# EAGLE design Attiny85VUSB (EAGLE 7.4.0)
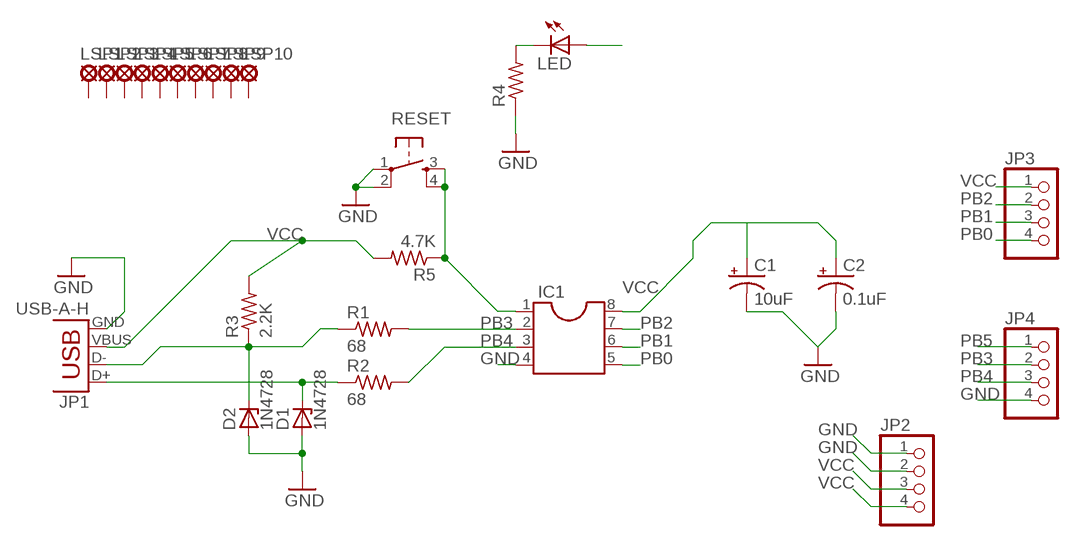
[diagram p0: schematic, sheet 1]

## Parts
C1  10uF  CAP_POLPTH1  [CPOL-RADIAL-100UF-25V]
C2  0.1uF  CAP_POLPTH1  [CPOL-RADIAL-100UF-25V]
D1  1N4728  [DO41Z10]
D2  1N4728  [DO41Z10]
IC1  ATTINY85TESTS  [SOCKET-08]
JP1  USB-A-H  [USB-A-H]
JP2  PINHD-1X4  [1X04]
JP3  PINHD-1X4  [1X04]
JP4  PINHD-1X4  [1X04]
LED  LED5MM  [LED5MM]
LSP1  MCS08  [MCS08]
LSP2  MCS08  [MCS08]
LSP3  MCS08  [MCS08]
LSP4  MCS08  [MCS08]
LSP5  MCS08  [MCS08]
LSP6  MCS08  [MCS08]
LSP7  MCS08  [MCS08]
LSP8  MCS08  [MCS08]
LSP9  MCS08  [MCS08]
LSP10  MCS08  [MCS08]
R1  68  R-US_0207/9  [0207/9]
R2  68  R-US_0207/9  [0207/9]
R3  2.2K  R-US_0207/9  [0207/9]
R4  R-US_0207/9  [0207/9]
R5  4.7K  R-US_0207/9  [0207/9]
RESET  TAC_SWITCHPTH  [TACTILE-PTH]

## Nets
DMIN: D2.C JP1.D- R1.1 R3.1
DPLUS: D1.C JP1.D+ R2.1
GND: C1.2(-) C2.2(-) D1.A D2.A IC1.4(GND) JP1.GND JP2.1 JP2.2 JP4.4 R4.1 RESET.1 RESET.2
N$2: LED.K(C) R4.2
PB0: IC1.5(PB0MOSI) JP3.4
PB1: IC1.6(PB1_MISO) JP3.3 LED.A
PB2: IC1.7(PB2SCK) JP3.2
PB3: IC1.2(PB3_CLKI) JP4.2 R1.2
PB4: IC1.3(PB4_CLKO) JP4.3 R2.2
PB5: JP4.1
RESET: IC1.1(PB5_~RESET) R5.1 RESET.3 RESET.4
VCC: C1.1(+) C2.1(+) IC1.8(VCC) JP1.VBUS JP2.3 JP2.4 JP3.1 R3.2 R5.2
Unconnected: LSP1.MP LSP2.MP LSP3.MP LSP4.MP LSP5.MP LSP6.MP LSP7.MP LSP8.MP LSP9.MP LSP10.MP

## Library data of the parts
C1 C2 = SparkFun-Capacitors:CAP_POL: Capacitor Polarized These are standard SMD and PTH capacitors. Normally 10uF, 47uF, and 100uF in electrolytic and tantalum varieties. Always verify the external diameter of the through hole cap, it varies with capacity, voltage, and manufacturer. The EIA devices should be standard.
D1 D2 = diode:1N4728: Z DIODE 3.3 V, 1W, 5 percent
IC1 = digital-ic:ATTINY85TEST: ATTiny85 Test
JP1 = SparkFun-Connectors:USB: USB Connectors USB-B-PTH is fully proven SKU : PRT-00139/CONN-08278 USB-miniB is fully proven SKU : PRT-00587 USB-A-PCB is untested. USB-A-H is throughly reviewed, but untested. Spark Fun Electronics SKU : PRT-00437 USB-B-SMT is throughly reviewed, but untested. Needs silkscreen touching up. USB-A-S has not been used/tested USB-MB-H has not been used/tested USB-MICROB has been used. CONN-09505; PROD_ID: CONN-08367
JP2-JP4 = pinhead:PINHD-1X4: PIN HEADER
LED = adafruit:LED: LED OSRAM: - CHIPLED LG R971, LG N971, LY N971, LG Q971, LY Q971, LO R971, LY R971 LH N974, LH R974 LS Q976, LO Q976, LY Q976 LO Q996 - Hyper CHIPLED LW Q18S LB Q993, LB Q99A, LB R99A - SideLED LS A670, LO A670, LY A670, LG A670, LP A670 LB A673, LV A673, LT A673, LW A673 LH A674 LY A675 LS A676, LA A676, LO A676, LY A676, LW A676 LS A679, LY A679, LG A679 - Hyper Micro SIDELED® LS Y876, LA Y876, LO Y876, LY Y876 LT Y87S - SmartLED LW L88C, LW L88S LB L89C, LB L89S, LG L890 LS L89K, LO L89K, LY L89K LS L896, LA L896, LO L896, LY L896 - TOPLED LS T670, LO T670, LY T670, LG T670, LP T670 LSG T670, LSP T670, LSY T670, LOP T670, LYG T670 LG T671, LOG T671, LSG T671 LB T673, LV T673, LT T673, LW T673 LH T674 LS T676, LA T676, LO T676, LY T676, LB T676, LH T676, LSB T676, LW T676 LB T67C, LV T67C, LT T67C, LS T67K, LO T67K, LY T67K, LW E67C LS E67B, LA E67B, LO E67B, LY E67B, LB E67C, LV E67C, LT E67C LW T67C LS T679, LY T679, LG T679 LS T770, LO T770, LY T770, LG T770, LP T770 LB T773, LV T773, LT T773, LW T773 LH T774 LS E675, LA E675, LY E675, LS T675 LS T776, LA T776, LO T776, LY T776, LB T776 LHGB T686 LT T68C, LB T68C - Hyper Mini TOPLED® LB M676 - Mini TOPLED Santana® LG M470 LS M47K, LO M47K, LY M47K Source: http://www.osram.convergy.de/
LSP1-LSP10 = solpad:MCS08: SOLDER PAD MC S0,8, drill 1.2 mm, distributor Buerklin, 08F130
R1-R5 = adafruit:R-US_: RESISTOR, American symbol
RESET = SparkFun-Retired:TAC_SWITCH: Momentary Switch Button commonly used for reset or general input. Spark Fun Electronics SKU : COM-00097 SMT- SWCH-08247

## Board
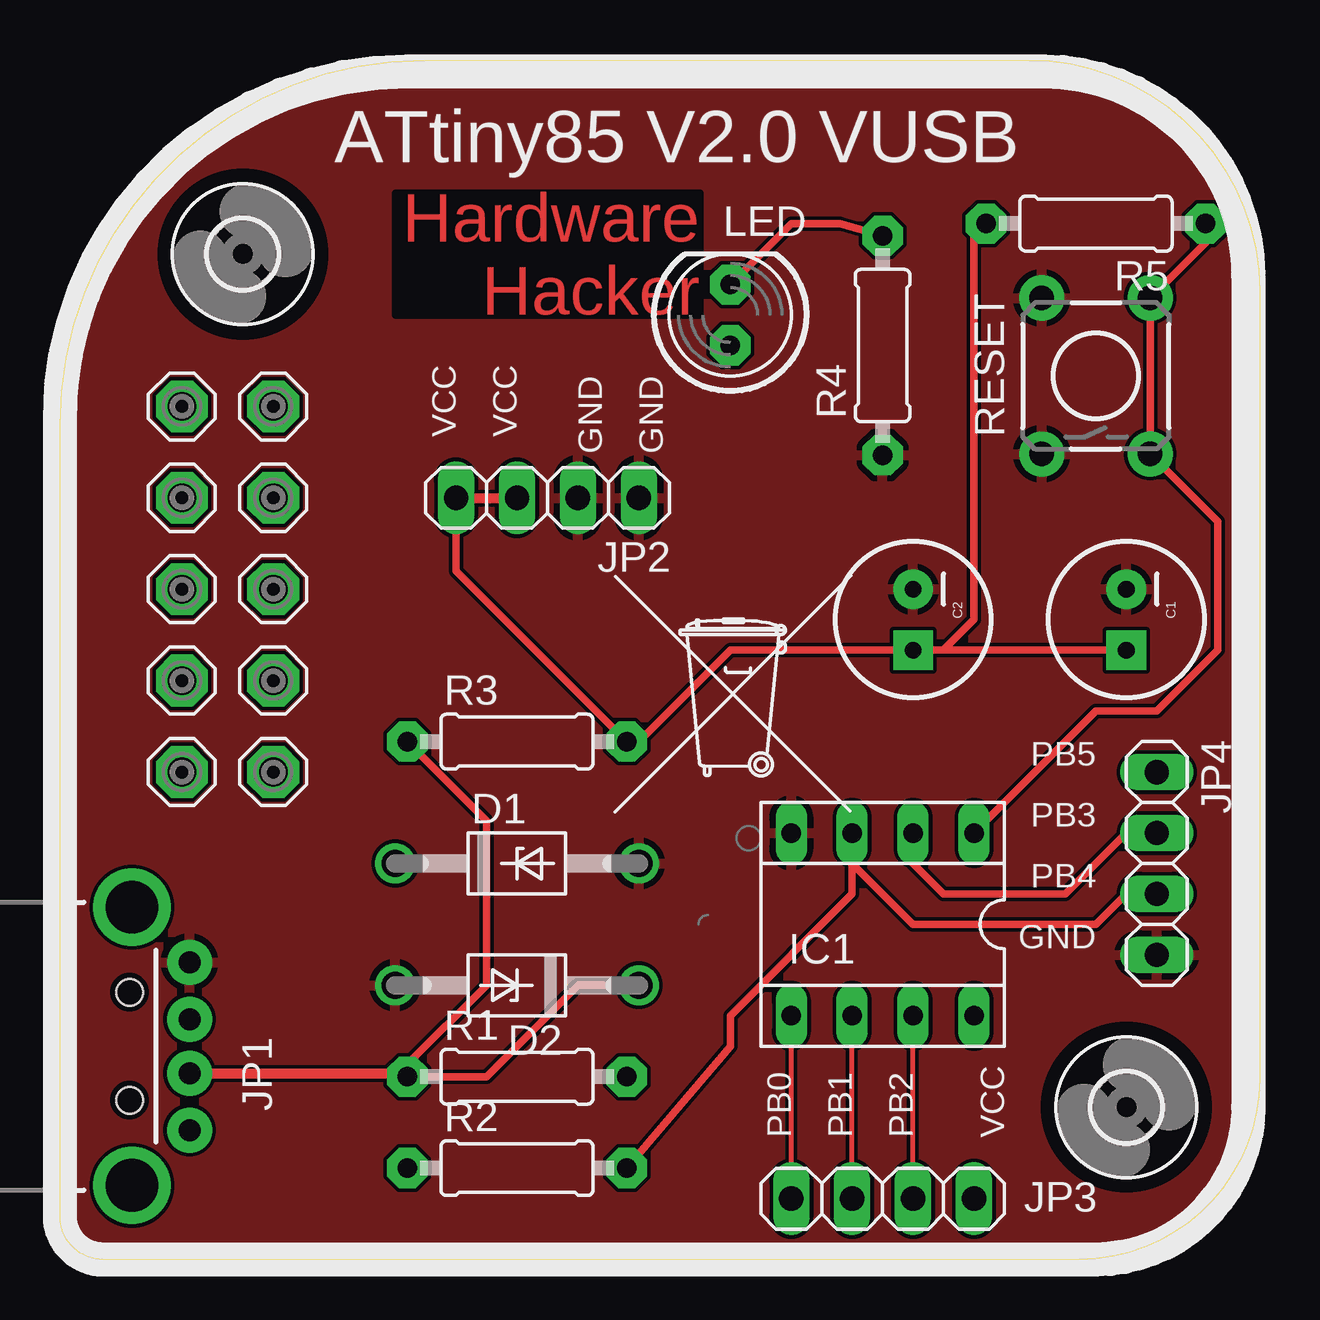
[diagram p1: board, top side]
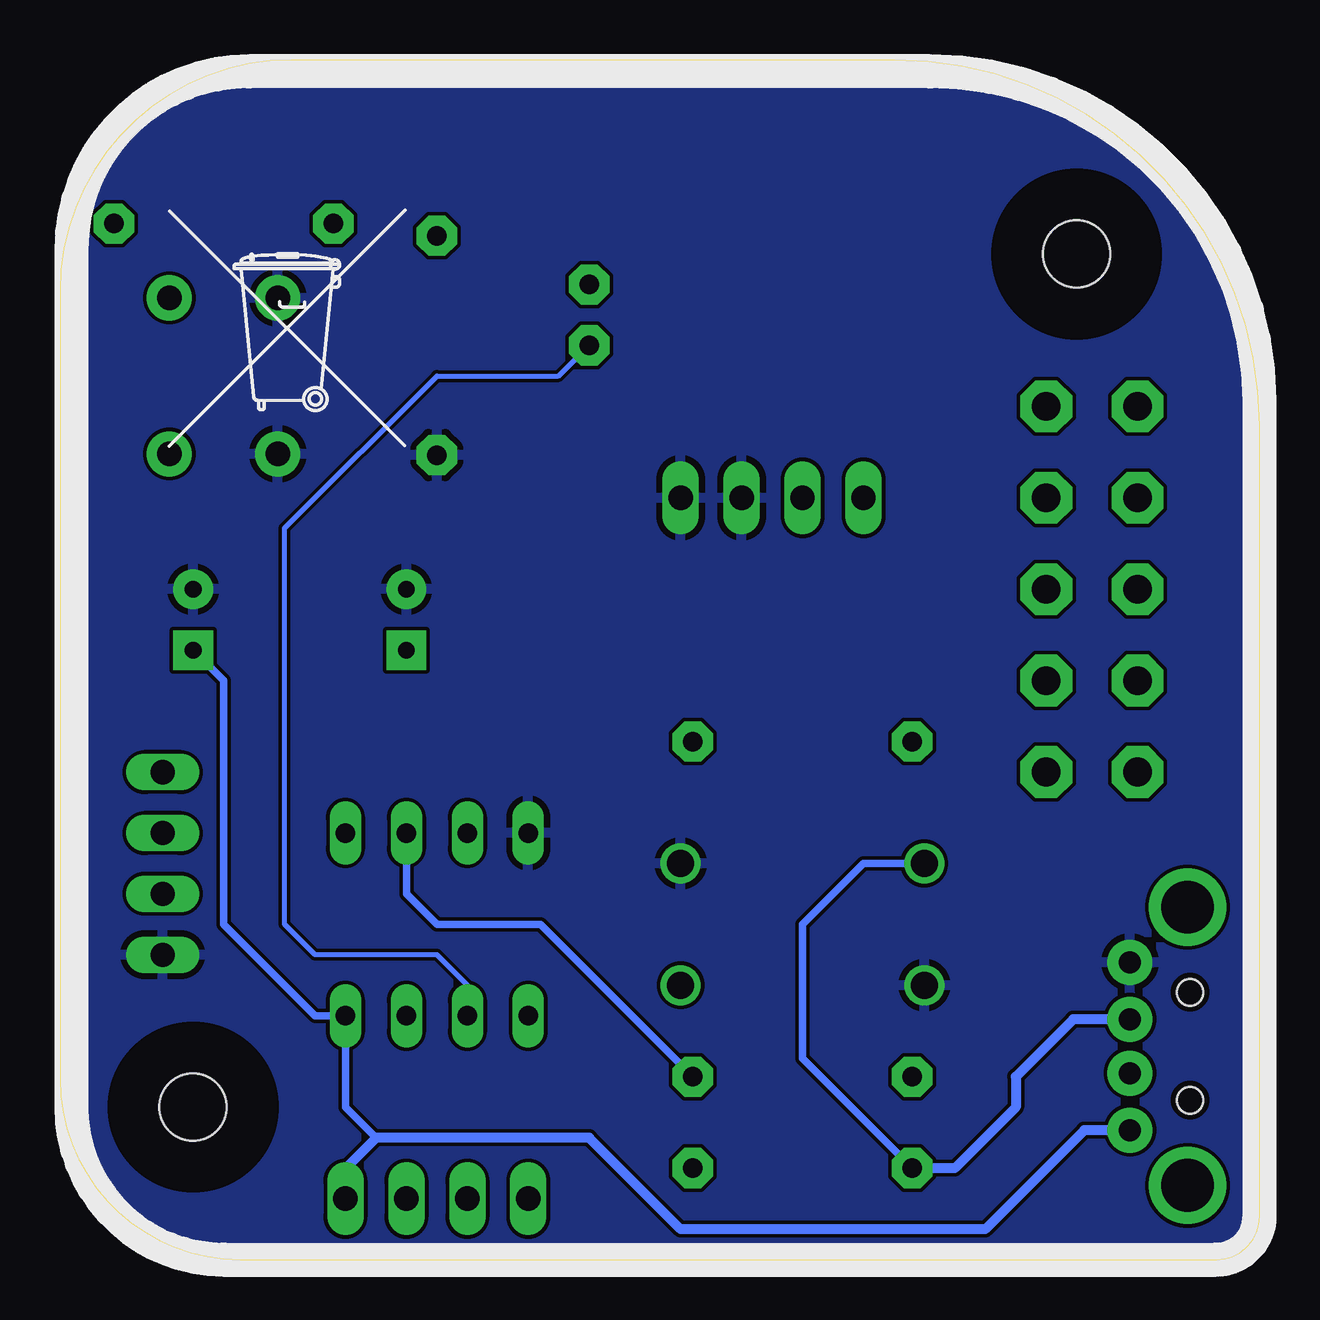
[diagram p2: board, bottom side, seen from below]

Size 50 x 50 mm. Coordinates in mm from the lower left corner, seen from the top.
Outline: 50,40.35 50,7.52 arc-90 42.48,0 1.8,0 arc-90 0,1.8 0,34.78 arc-90 15.22,50 40.35,50 arc-90 50,40.35
Copper layers (1*16): Top 0.035mm / dielectric 1.5mm / Bottom 0.035mm
Design rules "SeeedStudio_2layer_DRU_no_angle_20140221": minimum track width 6mil, minimum drill 12mil, track to track 6mil, track to pad 6mil, pad to pad 6mil, via to via 6mil, smd to smd 0mil, copper to edge 10mil, drill to drill 10mil, minimum pad ring 10mil, minimum via ring 6mil, stop-mask expansion 2mil, vias tented up to drill 100mil, thermal gap 10mil

### Footprints (pad centres in the part's own frame; a part is rotated, then mirrored left to right if it is on the bottom)
CPOL-RADIAL-100UF-25V = drill 0.7 pad 1.651 square: 1 1.27,0 | drill 0.7 pad 1.651: 2 -1.27,0
DO41Z10 = drill 1.118: A 5.08,0; C -5.08,0
SOCKET-08 = drill 0.813 long: 1 -3.81,-3.81; 2 -1.27,-3.81; 3 1.27,-3.81; 4 3.81,-3.81; 5 3.81,3.81; 6 1.27,3.81; 7 -1.27,3.81; 8 -3.81,3.81
USB-A-H = drill 0.914 pad 1.88: D+ 2.4,1.127; D- 2.4,-1.127; GND 2.4,3.5; VBUS 2.4,-3.5 | drill 2.2: GND2 0,-5.8; GND3 0,5.8 | hole 1.1: -0.1,2.25; -0.1,-2.25
1X04 = drill 1.016 long: 1 -3.81,0; 2 -1.27,0; 3 1.27,0; 4 3.81,0
LED5MM = drill 0.813 pad 1.676 octagon: A -1.27,0; K 1.27,0
MCS08 = drill 1.194 pad 2.159 octagon: MP 0,0
0207/9 = drill 0.813 pad 1.676 octagon: 1 -4.572,0; 2 4.572,0
TACTILE-PTH = drill 1.016 pad 1.88: 1 -3.251,2.261; 2 3.251,2.261; 3 -3.251,-2.261; 4 3.251,-2.261
2,8 = hole 2.8: 0,0

### Placement (x,y rotation side)
C1  44.45,26.67 270 top
C2  35.56,26.67 270 top
D1  19.05,16.51 0 top
D2  19.05,11.43 180 top
IC1  34.29,13.97 180 top
JP1  3,8.89 0 top
JP2  20.32,31.75 180 top
JP3  34.29,2.54 180 top
JP4  45.72,16.51 270 top
LED  27.94,39.37 90 top
LSP1  5.08,31.75 0 top
LSP2  8.89,20.32 0 top
LSP3  5.08,27.94 0 top
LSP4  8.89,31.75 0 top
LSP5  5.08,35.56 0 top
LSP6  5.08,24.13 0 top
LSP7  8.89,24.13 0 top
LSP8  8.89,27.94 0 top
LSP9  8.89,35.56 0 top
LSP10  5.08,20.32 0 top
R1  19.05,7.62 0 top
R2  19.05,3.81 0 top
R3  19.05,21.59 0 top
R4  34.29,38.1 90 top
R5  43.18,43.18 180 top
RESET  43.18,36.83 90 top
U$1  [TONNE_10.00]  27.94,21.59 0 top
U$2  [TONNE_10.00]  40.64,36.83 0 bottom
U$3  [2,8]  44.45,6.35 0 top
U$4  [2,8]  7.62,41.91 0 top
U$5  [LOGO]  29.21,10.16 90 top

### Tracks (layer width: path | path; a pad name or v marks a point on that pad's centre or on a via)
DMIN
  Top 0.305: D2.C 21.59,11.43 17.78,7.62 R1.1 14.48,8.13 17.78,11.43 17.78,18.29 R3.1
  Top 0.406: JP1.D- 14.34,7.76 R1.1
DPLUS
  Bottom 0.305: D1.C 16.51,16.51 19.05,13.97 19.05,8.38 R2.1
  Bottom 0.406: JP1.D+ 7.76,10.02 10.16,7.62 10.16,6.35 12.7,3.81 R2.1
GND
  pour Top: 0,0 50,0 50,50 0,50
  pour Bottom: 0,0 50,0 50,50 0,50
N$2
  Top 0.305: LED.K 30.48,43.18 32.51,43.18 R4.2
PB0
  Top 0.203: JP3.4 IC1.5
PB1
  Top 0.203: JP3.3 IC1.6
  Bottom 0.203: IC1.6 33.02,11.43 34.29,12.7 39.37,12.7 40.64,13.97 40.64,30.48 34.29,36.83 29.21,36.83 LED.A
PB2
  Top 0.203: JP3.2 IC1.7
PB3
  Top 0.305: IC1.2 35.56,16.51 36.83,15.24 41.91,15.24 44.45,17.78 JP4.2
  Bottom 0.305: R1.2 29.97,13.97 34.29,13.97 35.56,15.24 IC1.2
PB4
  Top 0.305: R2.2 27.94,8.89 27.94,10.16 33.02,15.24 IC1.3 33.02,16.51 35.56,13.97 43.18,13.97 44.45,15.24 JP4.3
RESET
  Top 0.305: IC1.1 43.18,22.86 45.72,22.86 48.26,25.4 48.26,30.76 RESET.3 RESET.4 47.75,42.39 R5.1
VCC
  Top 0.305: JP2.4 16.51,28.7 R3.2 24.13,21.59 27.94,25.4 C2.1 | C2.1 C1.1 | C2.1 36.83,25.4 38.1,26.67 38.1,42.67 R5.2
  Top 0.406: JP2.4 JP2.3
  Bottom 0.305: 36.83,5.08 38.1,6.35 IC1.8 39.37,10.16 43.18,13.97 43.18,24.13 C1.1
  Bottom 0.406: JP3.1 38.1,3.81 36.83,5.08 27.94,5.08 24.13,1.27 11.43,1.27 7.31,5.39 JP1.VBUS

### Text on the board
Top: Hardware / Hacker
tNames: ATtiny85 V2.0 VUSB | GND | GND | VCC | VCC | PB5 | PB3 | PB4 | GND | PB0 | PB1 | PB2 | VCC